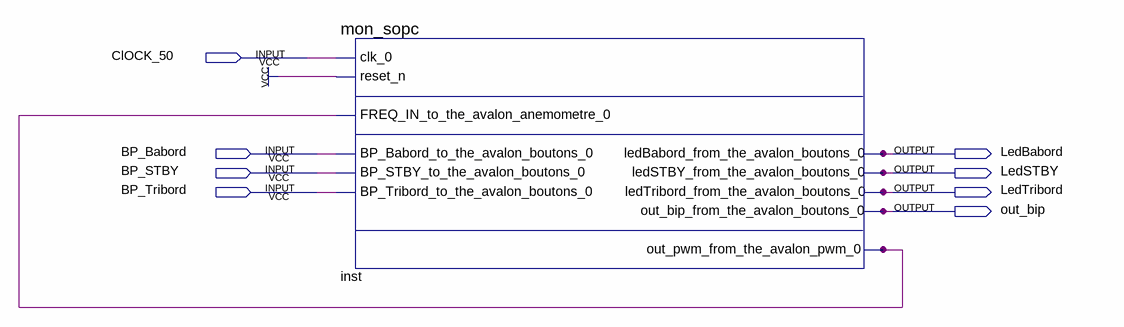
[diagram p0: schematic sheet]
// Quartus schematic sopc_cpmpteur.bdf as structural Verilog: 1 symbols, 8 pins
module sopc_cpmpteur (
  input  ClOCK_50,
  input  BP_Babord,
  input  BP_STBY,
  input  BP_Tribord,
  output LedBabord,
  output LedSTBY,
  output LedTribord,
  output out_bip
);

  wire inst_out_pwm_from_the_avalon_pwm_0;

  mon_sopc inst (
    .clk_0(ClOCK_50), .reset_n(1'b1),
    .FREQ_IN_to_the_avalon_anemometre_0(inst_out_pwm_from_the_avalon_pwm_0),
    .BP_Babord_to_the_avalon_boutons_0(BP_Babord), .BP_STBY_to_the_avalon_boutons_0(BP_STBY),
    .BP_Tribord_to_the_avalon_boutons_0(BP_Tribord), .ledBabord_from_the_avalon_boutons_0(LedBabord),
    .ledSTBY_from_the_avalon_boutons_0(LedSTBY), .ledTribord_from_the_avalon_boutons_0(LedTribord),
    .out_bip_from_the_avalon_boutons_0(out_bip),
    .out_pwm_from_the_avalon_pwm_0(inst_out_pwm_from_the_avalon_pwm_0));
endmodule
